# Altium project TLine_Project.PrjPcb
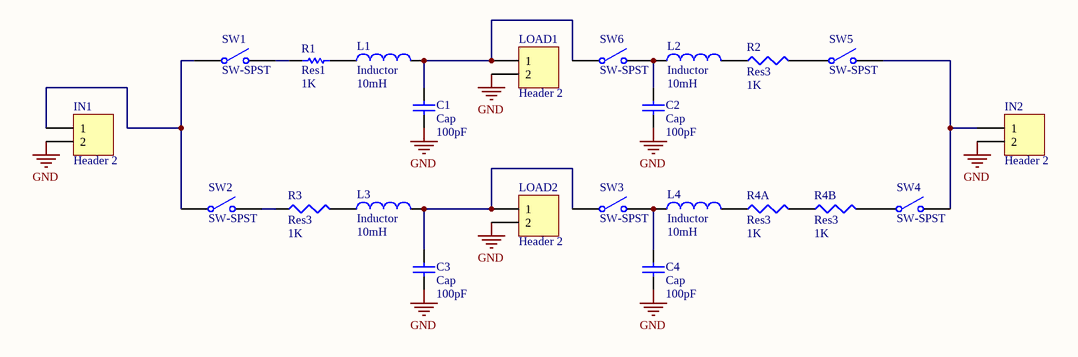
[diagram p0: TLine.SchDoc]
1 sheet, 23 parts. Net scope: global (net labels, ports and power ports of the same name join across sheets).
Board file: TLinePCB.PcbDoc

## Sheet TLine.SchDoc
size A

### Parts
C1  Cap  value 100pF  [capcap]
C2  Cap  value 100pF  [CapBig]
C3  Cap  value 100pF  [CapBig]
C4  Cap  value 100pF  [capcap]
IN1  Header 2  [TB]
IN2  Header 2  [TB]
L1  Inductor  value 10mH  [Inductor1]
L2  Inductor  value 10mH  [Inductor1]
L3  Inductor  value 10mH  [Inductor1]
L4  Inductor  value 10mH  [Inductor4]
LOAD1  Header 2  [CAPhoriz]
LOAD2  Header 2  [CAPhoriz]
R1  Res1  value 1K  [Resistor1]
R2  Res3  value 1K  [Resistor3]
R3  Res3  value 1K  [Resistor3]
R4A  Res3  value 1K  [Resistor3]
R4B  Res3  value 1K  [Resistor3]
SW1  SW-SPST  [Switch]
SW2  SW-SPST  [Switch]
SW3  SW-SPST  [Switch]
SW4  SW-SPST  [Switch]
SW5  SW-SPST  [Switch]
SW6  SW-SPST  [Switch]

### Nets
GND: C1.1 C2.1 C3.1 C4.1 IN1.2 IN2.2 LOAD1.2 LOAD2.2
NetC1_2: C1.2 L1.2 LOAD1.1 SW6.1(COMMON)
NetC2_2: C2.2 L2.1 SW6.2(NO)
NetC3_2: C3.2 L3.2 LOAD2.1 SW3.1(COMMON)
NetC4_2: C4.2 L4.1 SW3.2(NO)
NetIN1_1: IN1.1 SW1.1(COMMON) SW2.1(COMMON)
NetIN2_1: IN2.1 SW4.2(NO) SW5.2(NO)
NetL1_1: L1.1 R1.2
NetL2_2: L2.2 R2.1
NetL3_1: L3.1 R3.2
NetL4_2: L4.2 R4A.1
NetR1_1: R1.1 SW1.2(NO)
NetR2_2: R2.2 SW5.1(COMMON)
NetR3_1: R3.1 SW2.2(NO)
NetR4A_2: R4A.2 R4B.1
NetR4B_2: R4B.2 SW4.1(COMMON)

### Library data of the parts
C1-C4 = Cap: Capacitor; Published: 8-Jun-2000; LatestRevisionDate: 17-Jul-2002; LatestRevisionNote: Re-released for DXP Platform.; PackageReference: RAD-0.3; Publisher: Altium Limited
IN1 IN2 LOAD1 LOAD2 = Header 2: Header, 2-Pin; LatestRevisionDate: 17-Jul-2002; LatestRevisionNote: Re-released for DXP Platform.; Publisher: Altium Limited
L1-L4 = Inductor: Code_IEC: 1005; Published: 8-Jun-2000; LatestRevisionDate: 29-May-2009; LatestRevisionNote: IPC-7351 Footprint Added.; PackageReference: 0402-A; Publisher: Altium Limited; PackageDescription: Chip Inductor; Code_JEITA: 0402
R1 = Res1: Resistor; Published: 8-Jun-2000; LatestRevisionDate: 17-Jul-2002; LatestRevisionNote: Re-released for DXP Platform.; PackageReference: AXIAL-0.3; Publisher: Altium Limited
R2 R3 R4A R4B = Res3: Resistor; Published: 8-Jun-2000; LatestRevisionDate: 29-May-2009; LatestRevisionNote: IPC-7351 Footprint Added.; PackageReference: J1-0603; Publisher: Altium Limited; PackageDescription: Chip Resistor
SW1-SW6 = SW-SPST: Single-Pole, Single-Throw Switch; Published: 24-Mar-1999; LatestRevisionDate: 17-Jul-2002; LatestRevisionNote: Re-released for DXP Platform.; PackageReference: SPST-2; Publisher: Altium Limited